# Altium schematic sheet MCU_MKE185F512VLH16.SchDoc: Microcontroller
size A4; DrawnBy: Alvin Ha; DocumentNumber: MCU2018-2; Revision: 2.0; SheetNumber: 2; SheetTotal: 4
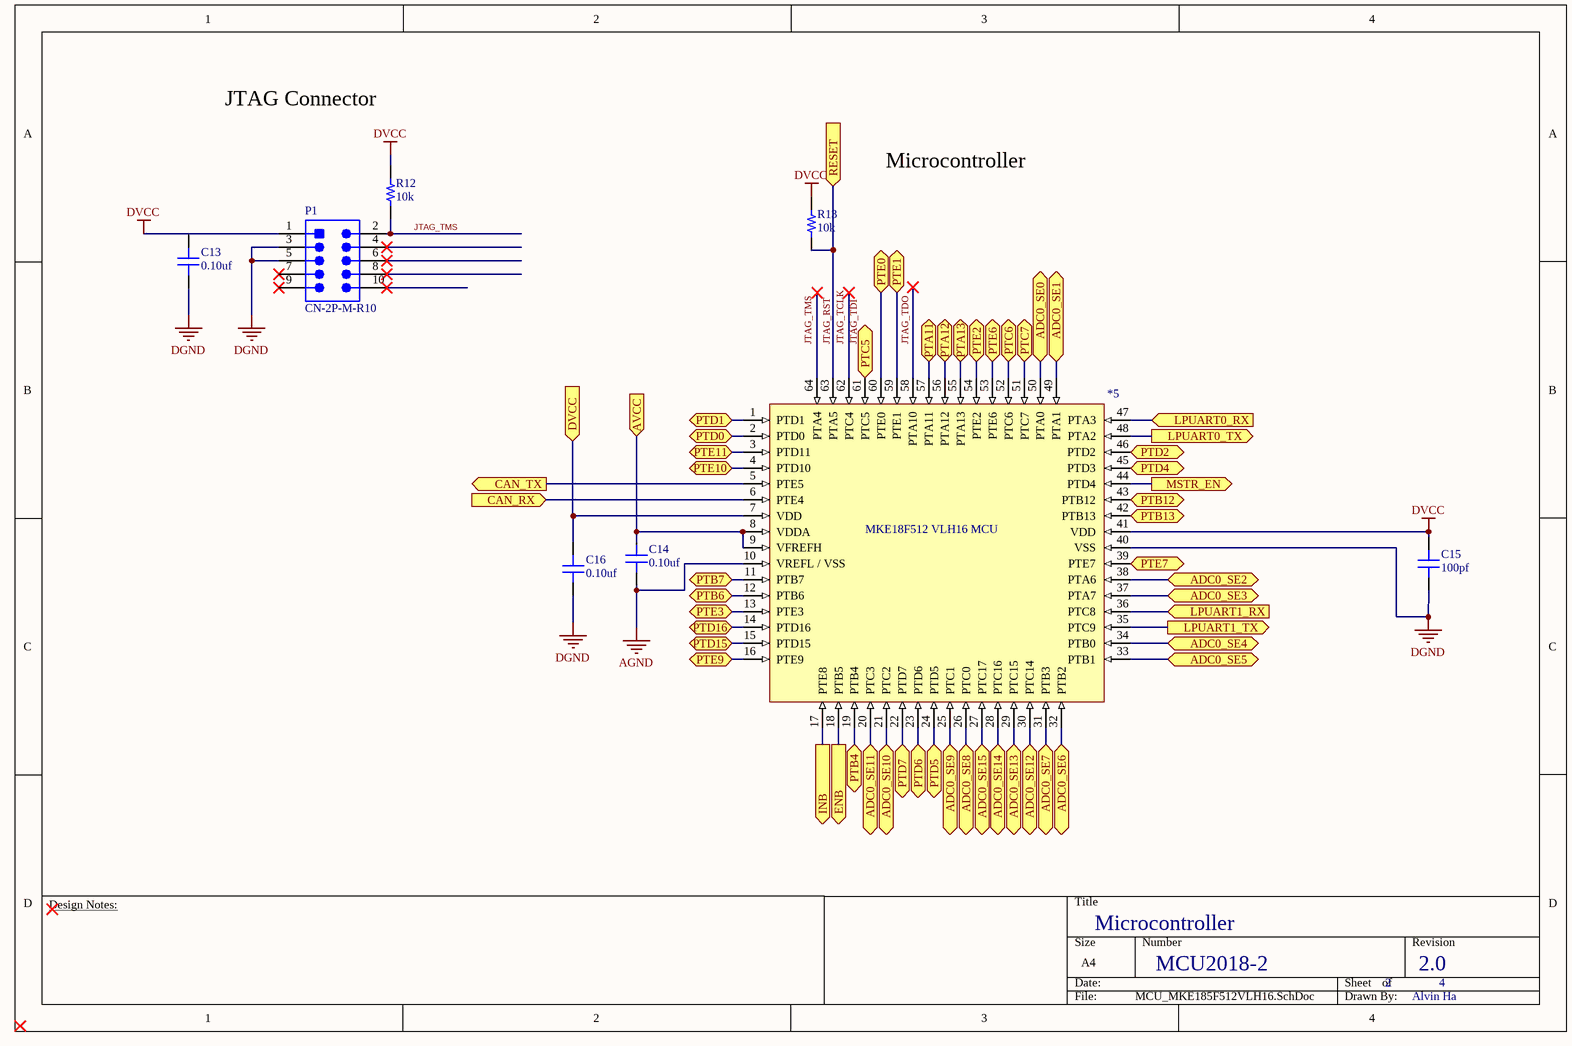
[diagram p0: MCU_MKE185F512VLH16.SchDoc]

## Parts
*5  MKE18F512 VLH16 MCU  [TQFP64]
C13  value 0.10uf  [CAP 0603/1608]  (hidden comment: Capacitor MLCC 0.10uf 16V CAP 0603/1608)
C14  value 0.10uf  [CAP 0603/1608]  (hidden comment: Capacitor MLCC 0.10uf 25V CAP 0603/1608)
C15  value 100pf  [CAP 0603/1608]  (hidden comment: Capacitor MLCC 100pf 25V CAP 0603/1608)
C16  value 0.10uf  [CAP 0603/1608]  (hidden comment: Capacitor MLCC 0.10uf 25V CAP 0603/1608)
P1  CN-2P-M-R10  [HDR2X5_SMT]
R12  value 10k  [RES 0603/1608]  (hidden comment: Resistor 10k 0603 1/10W 1%)
R13  value 10k  [RES 0603/1608]  (hidden comment: Resistor 10k 0603 1/10W 5%)

## Ports
ADC0_SE0 (bidir), ADC0_SE1 (bidir), ADC0_SE2 (bidir), ADC0_SE3 (bidir), ADC0_SE4 (bidir), ADC0_SE5 (bidir), ADC0_SE6 (bidir), ADC0_SE7 (bidir), ADC0_SE8 (bidir), ADC0_SE9 (bidir), ADC0_SE10 (bidir), ADC0_SE11 (bidir), ADC0_SE12 (bidir), ADC0_SE13 (bidir), ADC0_SE14 (bidir), ADC0_SE15 (bidir), AVCC (in), CAN_RX (in), CAN_TX (out), DVCC (in), ENB (out), INB (out), LPUART0_RX (in), LPUART0_TX (out), LPUART1_RX (in), LPUART1_TX (out), MSTR_EN (out), PTA11 (bidir), PTA12 (bidir), PTA13 (bidir), PTB4 (bidir), PTB6 (bidir), PTB7 (bidir), PTB12 (bidir), PTB13 (bidir), PTC5 (bidir), PTC6 (bidir), PTC7 (bidir), PTD0 (bidir), PTD1 (bidir), PTD2 (bidir), PTD4 (bidir), PTD5 (bidir), PTD6 (bidir), PTD7 (bidir), PTD15 (bidir), PTD16 (bidir), PTE0 (bidir), PTE1 (bidir), PTE2 (bidir), PTE3 (bidir), PTE6 (bidir), PTE7 (bidir), PTE9 (bidir), PTE10 (bidir), PTE11 (bidir), RESET (in)

## Nets
AGND: *5.10(VREFL_/_VSS) C14.1
DGND: *5.40(VSS) C13.1 C15.1 C16.1 P1.3 P1.5
DVCC: *5.41(VDD) C15.2 P1.1 R12.2 R13.2
ADC0_SE0: *5.50(PTA0) ; port ADC0_SE0
ADC0_SE1: *5.49(PTA1) ; port ADC0_SE1
ADC0_SE2: *5.38(PTA6) ; port ADC0_SE2
ADC0_SE3: *5.37(PTA7) ; port ADC0_SE3
ADC0_SE4: *5.34(PTB0) ; port ADC0_SE4
ADC0_SE5: *5.33(PTB1) ; port ADC0_SE5
ADC0_SE6: *5.32(PTB2) ; port ADC0_SE6
ADC0_SE7: *5.31(PTB3) ; port ADC0_SE7
ADC0_SE8: *5.26(PTC0) ; port ADC0_SE8
ADC0_SE9: *5.25(PTC1) ; port ADC0_SE9
ADC0_SE10: *5.21(PTC2) ; port ADC0_SE10
ADC0_SE11: *5.20(PTC3) ; port ADC0_SE11
ADC0_SE12: *5.30(PTC14) ; port ADC0_SE12
ADC0_SE13: *5.29(PTC15) ; port ADC0_SE13
ADC0_SE14: *5.28(PTC16) ; port ADC0_SE14
ADC0_SE15: *5.27(PTC17) ; port ADC0_SE15
AVCC: *5.8(VDDA) *5.9(VFREFH) C14.2 ; port AVCC
CAN_RX: *5.6(PTE4) ; port CAN_RX
CAN_TX: *5.5(PTE5) ; port CAN_TX
DVCC: *5.7(VDD) C16.2 ; port DVCC  [a separate net that carries the same name]
ENB: *5.18(PTB5) ; port ENB
INB: *5.17(PTE8) ; port INB
JTAG_RST: *5.63(PTA5) R13.1 ; port RESET
JTAG_TMS: P1.2 R12.1
LPUART0_RX: *5.47(PTA3) ; port LPUART0_RX
LPUART0_TX: *5.48(PTA2) ; port LPUART0_TX
LPUART1_RX: *5.36(PTC8) ; port LPUART1_RX
LPUART1_TX: *5.35(PTC9) ; port LPUART1_TX
MSTR_EN: *5.44(PTD4) ; port MSTR_EN
PTA11: *5.57(PTA11) ; port PTA11
PTA12: *5.56(PTA12) ; port PTA12
PTA13: *5.55(PTA13) ; port PTA13
PTB4: *5.19(PTB4) ; port PTB4
PTB6: *5.12(PTB6) ; port PTB6
PTB7: *5.11(PTB7) ; port PTB7
PTB12: *5.43(PTB12) ; port PTB12
PTB13: *5.42(PTB13) ; port PTB13
PTC5: *5.61(PTC5) ; port PTC5
PTC6: *5.52(PTC6) ; port PTC6
PTC7: *5.51(PTC7) ; port PTC7
PTD0: *5.2(PTD0) ; port PTD0
PTD1: *5.1(PTD1) ; port PTD1
PTD2: *5.46(PTD2) ; port PTD2
PTD4: *5.45(PTD3) ; port PTD4
PTD5: *5.24(PTD5) ; port PTD5
PTD6: *5.23(PTD6) ; port PTD6
PTD7: *5.22(PTD7) ; port PTD7
PTD15: *5.15(PTD15) ; port PTD15
PTD16: *5.14(PTD16) ; port PTD16
PTE0: *5.60(PTE0) ; port PTE0
PTE1: *5.59(PTE1) ; port PTE1
PTE2: *5.54(PTE2) ; port PTE2
PTE3: *5.13(PTE3) ; port PTE3
PTE6: *5.53(PTE6) ; port PTE6
PTE7: *5.39(PTE7) ; port PTE7
PTE9: *5.16(PTE9) ; port PTE9
PTE10: *5.4(PTD10) ; port PTE10
PTE11: *5.3(PTD11) ; port PTE11

Not connected (* = marked no-connect by the designer): *5 58(PTA10)* 62(PTC4)* 64(PTA4)*; C13 2; P1 4* 6* 7* 8* 9* 10*

## Notes on the sheet
- JTAG Connector
- Microcontroller
- Design Notes:
- Labels drawn without touching a wire or pin: JTAG_TCLK, JTAG_TDI, JTAG_TDO, JTAG_TMS

## Library data of the parts
*5 = 1: idMCU: 1; Manufacturer_id: 1; Drawer_id: 1; Name: MKE18F512VLH16 MCU
C13 = 223: Manufacturer_id: 1; idCapacitor: 223; Name: Cap_0.10uf_16V_CAP 0603/1608; Dielectric: Ceramic; Created_By: Nick Mah; Drawer_id: 1; Voltage_Rating: 16V; Package: CAP 0603/1608; Created_Date: 10/20/2018
C14 C16 = 583: Manufacturer_id: 1; idCapacitor: 583; Name: Cap_0.10uf_25V_CAP 0603/1608; Dielectric: Ceramic; Created_By: Nick Mah; Drawer_id: 1; Voltage_Rating: 25V; Package: CAP 0603/1608; Created_Date: 10/20/2018
C15 = 529: Manufacturer_id: 1; idCapacitor: 529; Name: Cap_100pf_25V_CAP 0603/1608; Dielectric: Ceramic; Created_By: Nick Mah; Drawer_id: 1; Voltage_Rating: 25V; Package: CAP 0603/1608; Created_Date: 10/20/2018
P1 = 4: 2 row connector; Manufacturer_id: 1; MfrPartNo: 5103309-1; idConn: 4; Name: CONN_TE_2X5POS; Value: CONN; Voltage_Rating: None; Num_Contacts: 10; Num_Rows: 2; Pitch: 2.54mm; Created_By: Aiku; Drawer_id: 1; Link: https://www.digikey.com/product-detail/en/5103309-1/A33160-ND/1114898?utm_campaign=buynow&WT.z_cid=ref_octopart_dkc_buynow&utm_medium=aggregator&curr=usd&site=us&utm_source=octopart; ComponentLink1Description: Datasheet
R12 = 313: Manufacturer_id: 1; idResistor: 313; Name: Res_10k_0603_1/10W_1%; Created_By: Nick Mah; Supplier 1: Digi-Key; Drawer_id: 1; Tolerance: 1%; Power: 1/10W; Package: 0603; ComponentLink1Description: Datasheet; Created_Date: 2018-10-20
R13 = 1393: Manufacturer_id: 1; idResistor: 1393; Name: Res_10k_0603_1/10W_5%; Created_By: Nick Mah; Supplier 1: Digi-Key; Drawer_id: 1; Tolerance: 5%; Power: 1/10W; Package: 0603; ComponentLink1Description: Datasheet; Created_Date: 2018-10-20